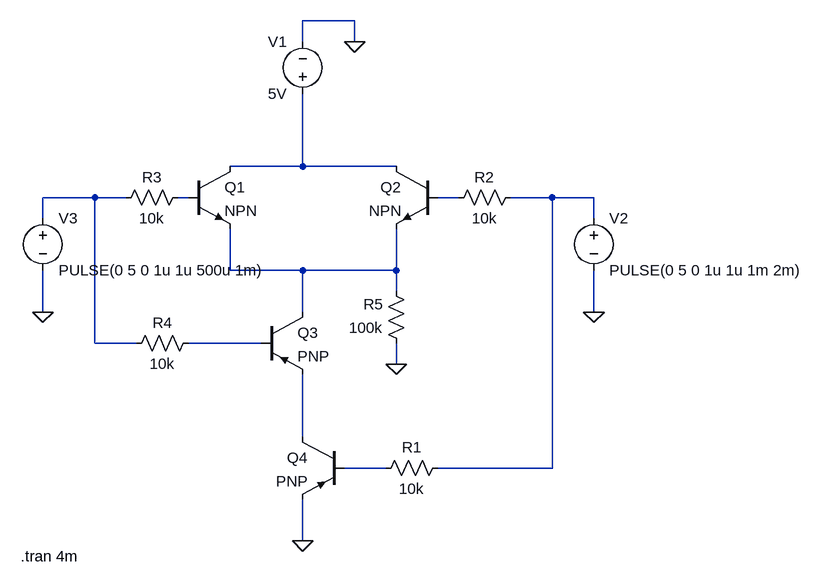
[diagram p0: schematic OrGate.asc]
OrGate.asc, the LTspice schematic file:
Version 4
SHEET 1 1044 696
WIRE 352 -144 272 -144
WIRE 272 -112 272 -144
WIRE 352 -112 352 -144
WIRE 272 80 272 -32
WIRE 272 80 160 80
WIRE 416 80 272 80
WIRE -48 128 -128 128
WIRE 0 128 -48 128
WIRE 96 128 80 128
WIRE 512 128 480 128
WIRE 656 128 592 128
WIRE 720 128 656 128
WIRE -128 160 -128 128
WIRE 720 160 720 128
WIRE 160 240 160 176
WIRE 272 240 160 240
WIRE 416 240 416 176
WIRE 416 240 272 240
WIRE 416 272 416 240
WIRE -128 304 -128 240
WIRE 272 304 272 240
WIRE 720 304 720 240
WIRE -48 352 -48 128
WIRE 16 352 -48 352
WIRE 208 352 96 352
WIRE 416 384 416 352
WIRE 272 496 272 400
WIRE 400 544 336 544
WIRE 656 544 656 128
WIRE 656 544 480 544
WIRE 272 656 272 592
FLAG 272 656 0
FLAG 352 -112 0
FLAG 720 304 0
FLAG -128 304 0
FLAG 416 384 0
SYMBOL npn 96 80 R0
SYMATTR InstName Q1
SYMBOL npn 480 80 M0
SYMATTR InstName Q2
SYMBOL pnp 208 304 R0
SYMATTR InstName Q3
SYMBOL pnp 336 496 M0
SYMATTR InstName Q4
SYMBOL voltage 272 -16 R180
WINDOW 0 24 96 Left 2
WINDOW 3 24 16 Left 2
WINDOW 123 0 0 Left 0
WINDOW 39 0 0 Left 0
SYMATTR InstName V1
SYMATTR Value 5V
SYMBOL voltage 720 144 R0
WINDOW 123 0 0 Left 0
WINDOW 39 0 0 Left 0
SYMATTR InstName V2
SYMATTR Value PULSE(0 5 0 1u 1u 1m 2m)
SYMBOL voltage -128 144 R0
WINDOW 123 0 0 Left 0
WINDOW 39 0 0 Left 0
SYMATTR InstName V3
SYMATTR Value PULSE(0 5 0 1u 1u 500u 1m)
SYMBOL res 496 528 R90
WINDOW 0 0 56 VBottom 2
WINDOW 3 32 56 VTop 2
SYMATTR InstName R1
SYMATTR Value 10k
SYMBOL res 608 112 R90
WINDOW 0 0 56 VBottom 2
WINDOW 3 32 56 VTop 2
SYMATTR InstName R2
SYMATTR Value 10k
SYMBOL res 96 112 R90
WINDOW 0 0 56 VBottom 2
WINDOW 3 32 56 VTop 2
SYMATTR InstName R3
SYMATTR Value 10k
SYMBOL res 112 336 R90
WINDOW 0 0 56 VBottom 2
WINDOW 3 32 56 VTop 2
SYMATTR InstName R4
SYMATTR Value 10k
SYMBOL res 432 368 R180
WINDOW 0 36 76 Left 2
WINDOW 3 36 40 Left 2
SYMATTR InstName R5
SYMATTR Value 100k
TEXT -162 680 Left 2 !.tran 4m

The netlist it stands for:
* OrGate.asc
Q1 N001 N003 N006 0 NPN
Q2 N001 N004 N006 0 NPN
Q3 N006 N007 N008 0 PNP
Q4 N008 N009 0 0 PNP
V1 N001 0 5V
V2 N005 0 PULSE(0 5 0 1u 1u 1m 2m)
V3 N002 0 PULSE(0 5 0 1u 1u 500u 1m)
R1 N005 N009 10k
R2 N005 N004 10k
R3 N003 N002 10k
R4 N007 N002 10k
R5 0 N006 100k
.model NPN NPN
.model PNP PNP
.lib standard.bjt
.tran 4m
.backanno
.end